# Altium project Signal Generator.PrjPcb (part 2 of 2)

## Sheet Interface.SchDoc
size A4; SheetNumber: 4; SheetTotal: 5
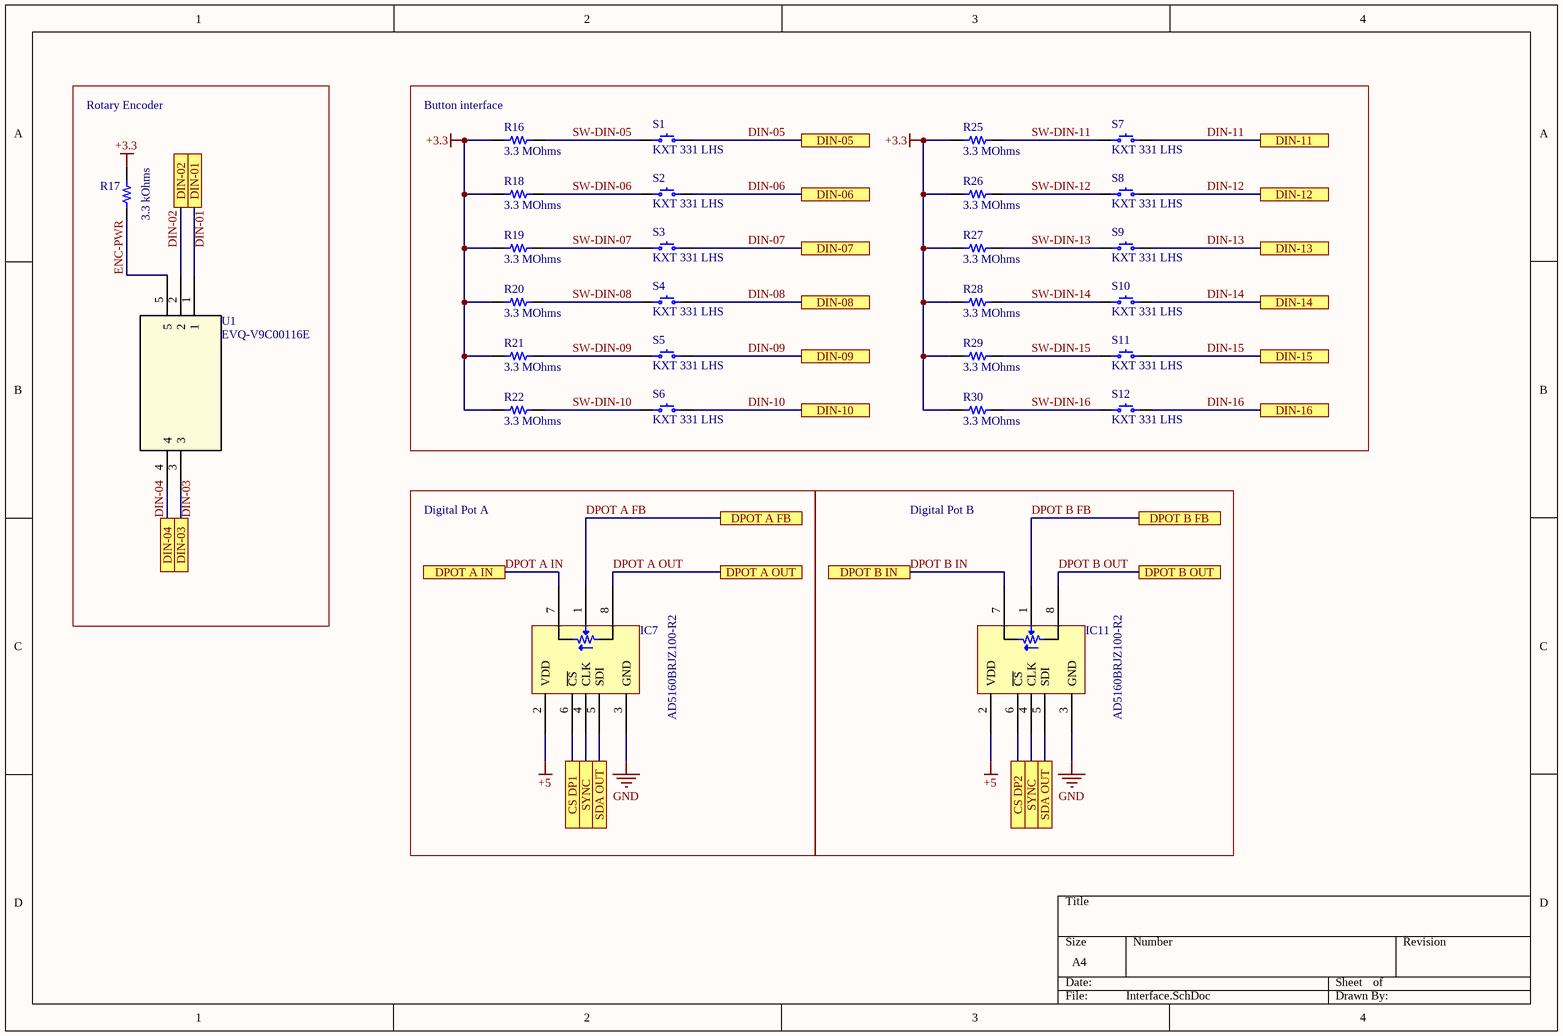
[diagram p3: Interface.SchDoc]

### Parts
IC7  AD5160BRJZ100-R2  [ANALOG SOT-23-8 RJ-8]
IC11  AD5160BRJZ100-R2  [ANALOG SOT-23-8 RJ-8]
R16  3.3 MOhms  [RES 1206_3216]
R17  3.3 kOhms  [RES 1206_3216]
R18  3.3 MOhms  [RES 1206_3216]
R19  3.3 MOhms  [RES 1206_3216]
R20  3.3 MOhms  [RES 1206_3216]
R21  3.3 MOhms  [RES 1206_3216]
R22  3.3 MOhms  [RES 1206_3216]
R25  3.3 MOhms  [RES 1206_3216]
R26  3.3 MOhms  [RES 1206_3216]
R27  3.3 MOhms  [RES 1206_3216]
R28  3.3 MOhms  [RES 1206_3216]
R29  3.3 MOhms  [RES 1206_3216]
R30  3.3 MOhms  [RES 1206_3216]
S1  KXT 331 LHS  [C&K KXT3]
S2  KXT 331 LHS  [C&K KXT3]
S3  KXT 331 LHS  [C&K KXT3]
S4  KXT 331 LHS  [C&K KXT3]
S5  KXT 331 LHS  [C&K KXT3]
S6  KXT 331 LHS  [C&K KXT3]
S7  KXT 331 LHS  [C&K KXT3]
S8  KXT 331 LHS  [C&K KXT3]
S9  KXT 331 LHS  [C&K KXT3]
S10  KXT 331 LHS  [C&K KXT3]
S11  KXT 331 LHS  [C&K KXT3]
S12  KXT 331 LHS  [C&K KXT3]
U1  EVQ-V9C00116E  [SW_EVQ-V9C00116E_PAN]

### Blocks framed on the sheet
Rotary Encoder: R17 U1
Button interface: R16 R18-R22 R25-R30 S1-S12
Digital Pot A: IC7
Digital Pot B: IC11

### Ports
CS DP1, CS DP2, DIN-01, DIN-02, DIN-03, DIN-04, DIN-05, DIN-06, DIN-07, DIN-08, DIN-09, DIN-10, DIN-11, DIN-12, DIN-13, DIN-14, DIN-15, DIN-16, DPOT A FB, DPOT A IN, DPOT A OUT, DPOT B FB, DPOT B IN, DPOT B OUT, SDA OUT, SYNC

### Nets
+3.3: R16.1 R17.2 R18.1 R19.1 R20.1 R21.1 R22.1 R25.1 R26.1 R27.1 R28.1 R29.1 R30.1  [project net 3.3V]
+5: IC7.2(VDD) IC11.2(VDD)
GND: IC7.3(GND) IC11.3(GND)
DIN-02: U1.2 ; port DIN-02
DIN-04: U1.4 ; port DIN-04
DIN-05: S1.2 ; port DIN-05
DIN-06: S2.2 ; port DIN-06
DIN-07: S3.2 ; port DIN-07
DIN-08: S4.2 ; port DIN-08
DIN-09: S5.2 ; port DIN-09
DIN-10: S6.2 ; port DIN-10
DIN-11: S7.2 ; port DIN-11
DIN-12: S8.2 ; port DIN-12
DIN-13: S9.2 ; port DIN-13
DIN-14: S10.2 ; port DIN-14
DIN-15: S11.2 ; port DIN-15
DIN-16: S12.2 ; port DIN-16
DPOT A FB: IC7.1(W) ; port DPOT A FB
DPOT A IN: IC7.7(A) ; port DPOT A IN
DPOT A OUT: IC7.8(B) ; port DPOT A OUT
DPOT B FB: IC11.1(W) ; port DPOT B FB
DPOT B IN: IC11.7(A) ; port DPOT B IN
DPOT B OUT: IC11.8(B) ; port DPOT B OUT
ENC-PWR: R17.1 U1.5
SDA OUT: IC7.5(SDI) IC11.5(SDI) ; port SDA OUT
SW-DIN-05: R16.2 S1.1
SW-DIN-06: R18.2 S2.1
SW-DIN-07: R19.2 S3.1
SW-DIN-08: R20.2 S4.1
SW-DIN-09: R21.2 S5.1
SW-DIN-10: R22.2 S6.1
SW-DIN-11: R25.2 S7.1
SW-DIN-12: R26.2 S8.1
SW-DIN-13: R27.2 S9.1
SW-DIN-14: R28.2 S10.1
SW-DIN-15: R29.2 S11.1
SW-DIN-16: R30.2 S12.1
SYNC: IC7.4(CLK) IC11.4(CLK) ; port SYNC
NetIC7_6: IC7.6(~{CS}) ; port CS DP1
NetIC11_6: IC11.6(~{CS}) ; port CS DP2
NetU1_1: U1.1 ; port DIN-01
NetU1_3: U1.3 ; port DIN-03

### Notes on the sheet
- Labels drawn without touching a wire or pin: DIN-01, DIN-03

### Library data of the parts
IC7 IC11 = AD5160BRJZ100-R2: IC DGTL POT 100KOHM 256TAP SOT23; Manufacturer: Analog Devices Inc.; Configuration: Potentiometer; Interface: SPI; Memory Type: Volatile; Number of Circuits: 1; Number of Taps: 256; Resistance (Ohms): 100k; Resistance - Wiper (Ohms) (Typ): 50; Temperature Coefficient (Typ): 45ppm/°C; Tolerance: ±15%; Voltage - Supply: 2.7V ~ 5.5V; Part Number: AD5160BRJZ100-R2; ComponentLink1Description: Datasheet; ComponentLink1URL: https://www.analog.com/media/en/technical-documentation/data-sheets/AD5160.pdf; ComponentLink2Description: DigiKey Link; ComponentLink2URL: http://digikey.com/product-detail/en/analog-devices-inc/AD5160BRJZ100-R2/AD5160BRJZ100-R2CT-ND/751230; LastUpdated: 3/06/2024 8:26:31 PM; Lifecycle Status: Active; Minimum Order: 1; Operating Temperature: -40°C ~ 125°C; Package / Case: SOT-23-8; Packaging: TapeAndReel; PartId: 39; Part Status: Active; Price: 1.68; Series: -; Supplier 1: DigiKey; Supplier Part Number 1: AD5160BRJZ100-R2CT-ND; Supplier Device Package: SOT-23-8; Taper: Linear
R16 R18-R22 R25-R30 = RG3216P-3304-B-T1: RES 3.3M OHM 0.1% 1/4W 1206; Manufacturer: Susumu; Power (Watts): 0.25W, 1/4W; Temperature Coefficient: ±25ppm/°C; Part Number: RG3216P-3304-B-T1; ComponentLink1Description: Datasheet; ComponentLink1URL: http://www.susumu.co.jp/common/pdf/n_catalog_partition01_en.pdf; ComponentLink2Description: DigiKey Link; ComponentLink2URL: https://www.digikey.com/en/products/detail/susumu/RG3216P-3304-B-T1/7035379; Composition: Thin Film; Device Package: 1206 (3216 Metric); Features: Anti-Sulfur, Automotive AEC-Q200; Height - Seated (Max): 0.020" (0.50mm); LastUpdated: 9/02/2024 8:54:00 PM; Lifecycle Status: Active; Minimum Order: 1; Number of Terminations: 2; Operating Temperature: -55°C ~ 155°C; Package / Case: 1206 (3216 Metric); Packaging: TapeAndReel; PartId: 38871; Part Status: Active; Price: 0.14; Ratings: AEC-Q200; Resistance: 3.3 MOhms; Series: RG; Size / Dimension: 0.126" L x 0.063" W (3.20mm x 1.60mm); Supplier 1: DigiKey; Supplier Part Number 1: 408-2035-1-ND; Supplier Device Package: 1206; Tolerance: ±0.1%; Value: 3.3 MOhms
R17 = ERA-8APB332V: RES SMD 3.3K OHM 0.1% 1/4W 1206; Manufacturer: Panasonic Electronic Components; Power (Watts): 0.25W, 1/4W; Temperature Coefficient: ±15ppm/°C; Part Number: ERA-8APB332V; ComponentLink1Description: Datasheet; ComponentLink1URL: https://industrial.panasonic.com/cdbs/www-data/pdf/RDM0000/AOA0000C307.pdf; ComponentLink2Description: DigiKey Link; ComponentLink2URL: https://www.digikey.com/en/products/detail/panasonic-electronic-components/ERA-8APB332V/5141025; Composition: Thin Film; Device Package: 1206 (3216 Metric); Features: Automotive AEC-Q200; Height - Seated (Max): 0.028" (0.70mm); LastUpdated: 9/02/2024 8:54:35 PM; Lifecycle Status: Active; Minimum Order: 1; Number of Terminations: 2; Operating Temperature: -55°C ~ 155°C; Package / Case: 1206 (3216 Metric); Packaging: TapeAndReel; PartId: 28968; Part Status: Active; Price: 0.31; Ratings: AEC-Q200; Resistance: 3.3 kOhms; Series: ERA-8A; Size / Dimension: 0.126" L x 0.063" W (3.20mm x 1.60mm); Supplier 1: DigiKey; Supplier Part Number 1: P3.3KCRCT-ND; Supplier Device Package: 1206; Tolerance: ±0.1%; Value: 3.3 kOhms
S1-S12 = KXT 331 LHS: SWITCH TACTILE SPST-NO 0.02A 15V; Manufacturer: C&K; Actuator Height off PCB, Vertical: 0.60mm; Actuator Orientation: Top Actuated; Actuator Type: Standard; Contact Rating @ Voltage: 0.02A @ 15VDC; Illumination: Non-Illuminated; Operating Force: 240gf; Outline: 3.00mm x 2.00mm; Switch Function: Off-Mom; Part Number: KXT 331 LHS; Circuit: SPST-NO; ComponentLink1Description: Datasheet; ComponentLink1URL: https://dznh3ojzb2azq.cloudfront.net/products/Tactile/KXT3/documents/datasheet.pdf; ComponentLink2Description: DigiKey Link; ComponentLink2URL: https://www.digikey.com/en/products/detail/c-k/KXT-331-LHS/6599754; LastUpdated: 3/06/2024 8:19:27 PM; Lifecycle Status: Active; Minimum Order: 1; Mounting Type: Surface Mount; Operating Temperature: -40°C ~ 85°C; Packaging: TapeAndReel; Part Status: Active; Price: 0.13; Series: KXT3; Supplier 1: DigiKey; Supplier Part Number 1: CKN10779CT-ND; Termination Style: SMD (SMT) Tab
U1 = EVQ-V9C00116E: No Description Available; Mfr_Name: Panasonic; RefDes: RefDes; Type: Type

## Sheet Shift register map.SchDoc
size A4; SheetNumber: 5; SheetTotal: 5
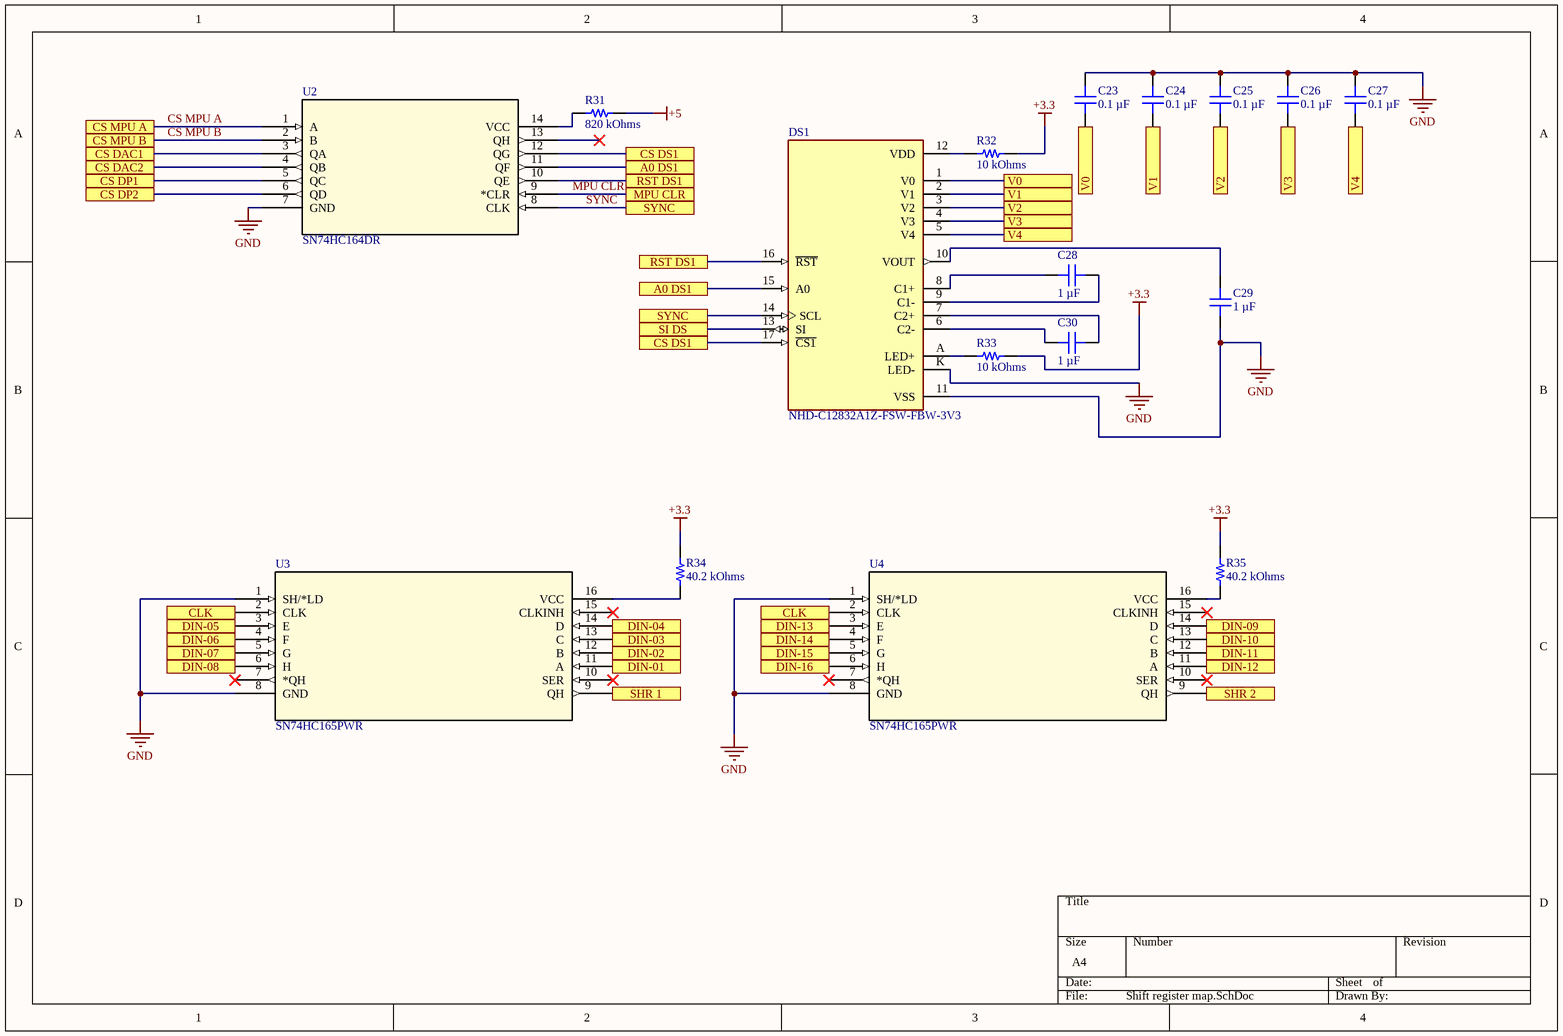
[diagram p4: Shift register map.SchDoc]

### Parts
C23  0.1 µF  [CAP 1210_3225 - 1MM]
C24  0.1 µF  [CAP 1210_3225 - 1MM]
C25  0.1 µF  [CAP 1210_3225 - 1MM]
C26  0.1 µF  [CAP 1210_3225 - 1MM]
C27  0.1 µF  [CAP 1210_3225 - 1MM]
C28  1 µF  [CAP 1210_3225 - 1MM]
C29  1 µF  [CAP 1210_3225 - 1MM]
C30  1 µF  [CAP 1210_3225 - 1MM]
DS1  NHD-C12832A1Z-FSW-FBW-3V3  [LCD_NHD-C12832A1Z-FSW-FBW-3V3]
R31  820 kOhms  [RES 1210_3225]
R32  10 kOhms  [RES 1210_3225]
R33  10 kOhms  [RES 1210_3225]
R34  40.2 kOhms  [RES 1206_3216]
R35  40.2 kOhms  [RES 1206_3216]
U2  SN74HC164DR  [SOP14]
U3  SN74HC165PWR  [PW16]
U4  SN74HC165PWR  [PW16]

### Ports
A0 DS1, CLK, CS DAC1, CS DAC2, CS DP1, CS DP2, CS DS1, CS MPU A, CS MPU B, DIN-01, DIN-02, DIN-03, DIN-04, DIN-05, DIN-06, DIN-07, DIN-08, DIN-09, DIN-10, DIN-11, DIN-12, DIN-13, DIN-14, DIN-15, DIN-16, MPU CLR, RST DS1, SHR 1, SHR 2, SI DS, SYNC, V0, V1, V2, V3, V4

### Nets
+3.3: R32.2 R33.2 R34.2 R35.2  [project net 3.3V]
+5: R31.2
GND: C23.2 C24.2 C25.2 C26.2 C27.2 C29.1 DS1.11(VSS) DS1.K(LED-) U2.7(GND) U3.1(SH/*LD) U3.8(GND) U4.1(SH/*LD) U4.8(GND)
CLK: U3.2(CLK) U4.2(CLK) ; port CLK
CS MPU A: U2.1(A) ; port CS MPU A
CS MPU B: U2.2(B) ; port CS MPU B
DIN-02: U3.12(B) ; port DIN-02
DIN-04: U3.14(D) ; port DIN-04
DIN-05: U3.3(E) ; port DIN-05
DIN-06: U3.4(F) ; port DIN-06
DIN-07: U3.5(G) ; port DIN-07
DIN-08: U3.6(H) ; port DIN-08
DIN-09: U4.14(D) ; port DIN-09
DIN-10: U4.13(C) ; port DIN-10
DIN-11: U4.12(B) ; port DIN-11
DIN-12: U4.11(A) ; port DIN-12
DIN-13: U4.3(E) ; port DIN-13
DIN-14: U4.4(F) ; port DIN-14
DIN-15: U4.5(G) ; port DIN-15
DIN-16: U4.6(H) ; port DIN-16
MPU CLR: U2.9(*CLR) ; port MPU CLR
SHR 1: U3.9(QH) ; port SHR 1
SHR 2: U4.9(QH) ; port SHR 2
SI DS: DS1.13(SI) ; port SI DS
SYNC: DS1.14(SCL) U2.8(CLK) ; port SYNC
NetC23_1: C23.1 DS1.1(V0) ; port V0
NetC24_1: C24.1 DS1.2(V1) ; port V1
NetC25_1: C25.1 DS1.3(V2) ; port V2
NetC26_1: C26.1 DS1.4(V3) ; port V3
NetC27_1: C27.1 DS1.5(V4) ; port V4
NetC28_1: C28.1 DS1.8(C1+)
NetC28_2: C28.2 DS1.9(C1-)
NetC29_2: C29.2 DS1.10(VOUT)
NetC30_1: C30.1 DS1.6(C2-)
NetC30_2: C30.2 DS1.7(C2+)
NetDS1_12: DS1.12(VDD) R32.1
NetDS1_15: DS1.15(A0) U2.11(QF) ; port A0 DS1
NetDS1_16: DS1.16(~{RST}) U2.10(QE) ; port RST DS1
NetDS1_17: DS1.17(~{CS1}) U2.12(QG) ; port CS DS1
NetDS1_A: DS1.A(LED+) R33.1
NetIC6_6: U2.3(QA) ; port CS DAC1
NetIC7_6: U2.5(QC) ; port CS DP1
NetIC8_6: U2.4(QB) ; port CS DAC2
NetIC11_6: U2.6(QD) ; port CS DP2
NetR31_1: R31.1 U2.14(VCC)
NetR34_1: R34.1 U3.16(VCC)
NetR35_1: R35.1 U4.16(VCC)
NetU1_1: U3.11(A) ; port DIN-01
NetU1_3: U3.13(C) ; port DIN-03

Not connected (* = marked no-connect by the designer): U2 13(QH)*; U3 7(*QH)* 10(SER)* 15(CLKINH)*; U4 7(*QH)* 10(SER)* 15(CLKINH)*

### Library data of the parts
C23-C27 = GMC32X7R104K100NT: CAP1210 X7R .1UF 10% 100V; manufacturer: Cal-Chip Electronics, Inc.; Part Number: GMC32X7R104K100NT; Value: 0.1 µF; Applications: General Purpose; Capacitance: 0.1 µF; componentlink1description: Datasheet; componentlink1url: https://calchip.com/wp-content/uploads/2023/05/gmc_series.pdf; componentlink2description: DigiKey Link; componentlink2url: https://www.digikey.com/en/products/detail/cal-chip-electronics-inc/GMC32X7R104K100NT/21802075; Device Package: 1210 (3225 Metric); lastupdated: 4/06/2024 7:20:42 PM; Lifecycle Status: Active; Minimum Order: 1; Mounting Type: Surface Mount, MLCC; Operating Temperature: -55°C ~ 125°C; Package / Case: 1210 (3225 Metric); packaging: TapeAndReel; partid: 58440; price: 0.05; series: GMC; Size / Dimension: 0.126" L x 0.098" W (3.20mm x 2.50mm); Supplier 1: DigiKey; Supplier Part Number 1: 4713-GMC32X7R104K100NTCT-ND; Temperature Coefficient: X7R; Thickness (Max): 0.087" (2.20mm); Tolerance: ±10%; Voltage - Rated: 100V
C28-C30 = GMC32X7R105K25NT: CAP1210 X7R 1UF 10% 25V; manufacturer: Cal-Chip Electronics, Inc.; Part Number: GMC32X7R105K25NT; Value: 1 µF; Applications: General Purpose; Capacitance: 1 µF; componentlink1description: Datasheet; componentlink1url: https://88ce57.p3cdn1.secureserver.net/wp-content/uploads/2023/01/gmc_series-2.pdf; componentlink2description: DigiKey Link; componentlink2url: https://www.digikey.com/en/products/detail/cal-chip-electronics-inc/GMC32X7R105K25NT/19910714; Device Package: 1210 (3225 Metric); lastupdated: 4/06/2024 7:20:43 PM; Lifecycle Status: Active; Minimum Order: 1; Mounting Type: Surface Mount, MLCC; Operating Temperature: -55°C ~ 125°C; Package / Case: 1210 (3225 Metric); packaging: TapeAndReel; partid: 56654; price: 0.06; series: GMC; Size / Dimension: 0.126" L x 0.098" W (3.20mm x 2.50mm); Supplier 1: DigiKey; Supplier Part Number 1: 4713-GMC32X7R105K25NTCT-ND; Temperature Coefficient: X7R; Thickness (Max): 0.071" (1.80mm); Tolerance: ±10%; Voltage - Rated: 25V
DS1 = NHD-C12832A1Z-FSW-FBW-3V3: Graphic LCD Display Module Transflective Black (White - Inverted) FSTN - Film Super-Twisted Nematic SPI 128 x 32; MF: Newhaven; Package: None; Purchase-URL: https://pricing.snapeda.com/search/part/NHD-C12832A1Z-FSW-FBW-3V3/?ref=eda; Price: None; Availability: Good; Check_prices: https://www.snapeda.com/parts/NHD-C12832A1Z-FSW-FBW-3V3/Newhaven%20Display%20Intl/view-part/275499/?ref=eda; MP: NHD-C12832A1Z-FSW-FBW-3V3; SnapEDA_Link: https://www.snapeda.com/parts/NHD-C12832A1Z-FSW-FBW-3V3/Newhaven%20Display%20Intl/view-part/275499/?ref=snap; Value: *
R31 = RMCF1210JT820K: RES 820K OHM 5% 1/3W 1210; Manufacturer: Stackpole Electronics Inc; Power (Watts): 0.333W, 1/3W; Temperature Coefficient: ±200ppm/°C; Part Number: RMCF1210JT820K; ComponentLink1Description: Datasheet; ComponentLink1URL: https://www.seielect.com/catalog/sei-rmcf_rmcp.pdf; ComponentLink2Description: DigiKey Link; ComponentLink2URL: https://www.digikey.com/en/products/detail/stackpole-electronics-inc/RMCF1210JT820K/1757292; Composition: Thick Film; Device Package: 1210 (3225 Metric); Features: Automotive AEC-Q200; Height - Seated (Max): 0.028" (0.70mm); LastUpdated: 3/06/2024 8:18:51 PM; Lifecycle Status: Active; Minimum Order: 1; Number of Terminations: 2; Operating Temperature: -55°C ~ 155°C; Package / Case: 1210 (3225 Metric); Packaging: TapeAndReel; Part Status: Active; Price: 0.02; Ratings: AEC-Q200; Resistance: 820 kOhms; Series: RMCF; Size / Dimension: 0.126" L x 0.098" W (3.20mm x 2.50mm); Supplier 1: DigiKey; Supplier Part Number 1: RMCF1210JT820KCT-ND; Supplier Device Package: 1210; Tolerance: ±5%; Value: 820 kOhms
R32 R33 = TNPW121010K0BEEN: RES 10K OHM 0.1% 1/2W 1210; Manufacturer: Vishay Dale; Power (Watts): 0.5W, 1/2W; Temperature Coefficient: ±25ppm/°C; Part Number: TNPW121010K0BEEN; ComponentLink1Description: Datasheet; ComponentLink1URL: http://www.vishay.com/docs/28758/tnpw_e3.pdf; ComponentLink2Description: DigiKey Link; ComponentLink2URL: https://www.digikey.com/en/products/detail/vishay-dale/TNPW121010K0BEEN/1611704; Composition: Thin Film; Device Package: 1210 (3225 Metric); Features: Anti-Sulfur, Automotive AEC-Q200, Moisture Resistant; Height - Seated (Max): 0.030" (0.75mm); LastUpdated: 3/06/2024 8:18:52 PM; Lifecycle Status: Active; Minimum Order: 1; Number of Terminations: 2; Operating Temperature: -55°C ~ 155°C; Package / Case: 1210 (3225 Metric); Packaging: TapeAndReel; Part Status: Active; Price: 0.91; Ratings: AEC-Q200; Resistance: 10 kOhms; Series: TNPW e3; Size / Dimension: 0.126" L x 0.096" W (3.20mm x 2.45mm); Supplier 1: DigiKey; Supplier Part Number 1: 541-TNPW121010K0BEENCT-ND; Supplier Device Package: 1210; Tolerance: ±0.1%; Value: 10 kOhms
R34 R35 = RMCF1206FT40K2: RES 40.2K OHM 1% 1/4W 1206; Manufacturer: Stackpole Electronics Inc; Power (Watts): 0.25W, 1/4W; Temperature Coefficient: ±100ppm/°C; Part Number: RMCF1206FT40K2; ComponentLink1Description: Datasheet; ComponentLink1URL: https://www.seielect.com/catalog/sei-rmcf_rmcp.pdf; ComponentLink2Description: DigiKey Link; ComponentLink2URL: https://www.digikey.com/en/products/detail/stackpole-electronics-inc/RMCF1206FT40K2/1754014; Composition: Thick Film; Device Package: 1206 (3216 Metric); Features: Automotive AEC-Q200; Height - Seated (Max): 0.028" (0.70mm); LastUpdated: 9/02/2024 8:54:45 PM; Lifecycle Status: Active; Minimum Order: 1; Number of Terminations: 2; Operating Temperature: -55°C ~ 155°C; Package / Case: 1206 (3216 Metric); Packaging: TapeAndReel; PartId: 26907; Part Status: Active; Price: 0.01; Ratings: AEC-Q200; Resistance: 40.2 kOhms; Series: RMCF; Size / Dimension: 0.126" L x 0.063" W (3.20mm x 1.60mm); Supplier 1: DigiKey; Supplier Part Number 1: RMCF1206FT40K2CT-ND; Supplier Device Package: 1206; Tolerance: ±1%; Value: 40.2 kOhms
U2 = SN74HC164DR: No Description Available; Mfr_Name: Texas Instruments; RefDes: RefDes; Type: Type
U3 U4 = SN74HC165PWR: No Description Available; Mfr_Name: Texas Instruments; RefDes: RefDes; Type: Type

## Nets that join several sheets
3.3V: PIC (9 pins), Power management (5 pins), Interface (13 pins), Shift register map (R32.2 R33.2 R34.2 R35.2)
+5: Power management (C20.1 D11.1 IC3.5 TP12.TP1), Interface (IC7.2 IC11.2), Shift register map (R31.2)
+6.5V: Power management (6 pins), Oscillator (IC6.3 IC8.3)
+12: Power management (6 pins), Oscillator (IC4.8 IC5.8)
-12: Power management (5 pins), Oscillator (IC4.4 IC5.4)
GND: PIC (21 pins), Power management (30 pins), Oscillator (12 pins), Interface (IC7.3 IC11.3), Shift register map (13 pins)
CLK: PIC (J3.13), Shift register map (U3.2 U4.2)
CS MPU A: PIC (J3.23), Shift register map (U2.1)
CS MPU B: PIC (J3.24), Shift register map (U2.2)
DIN-02: Interface (U1.2), Shift register map (U3.12)
DIN-04: Interface (U1.4), Shift register map (U3.14)
DIN-05: Interface (S1.2), Shift register map (U3.3)
DIN-06: Interface (S2.2), Shift register map (U3.4)
DIN-07: Interface (S3.2), Shift register map (U3.5)
DIN-08: Interface (S4.2), Shift register map (U3.6)
DIN-09: Interface (S5.2), Shift register map (U4.14)
DIN-10: Interface (S6.2), Shift register map (U4.13)
DIN-11: Interface (S7.2), Shift register map (U4.12)
DIN-12: Interface (S8.2), Shift register map (U4.11)
DIN-13: Interface (S9.2), Shift register map (U4.3)
DIN-14: Interface (S10.2), Shift register map (U4.4)
DIN-15: Interface (S11.2), Shift register map (U4.5)
DIN-16: Interface (S12.2), Shift register map (U4.6)
DPOT A FB: Oscillator (IC5.2), Interface (IC7.1)
DPOT A IN: Oscillator (IC4.1 IC4.2), Interface (IC7.7)
DPOT A OUT: Oscillator (IC5.1 J5.1), Interface (IC7.8)
DPOT B FB: Oscillator (IC5.6), Interface (IC11.1)
DPOT B IN: Oscillator (IC4.6 IC4.7), Interface (IC11.7)
DPOT B OUT: Oscillator (IC5.7 J6.1), Interface (IC11.8)
MPU CLR: PIC (J3.22), Shift register map (U2.9)
NetIC6_6: Oscillator (IC6.6), Shift register map (U2.3)
NetIC7_6: Interface (IC7.6), Shift register map (U2.5)
NetIC8_6: Oscillator (IC8.6), Shift register map (U2.4)
NetIC11_6: Interface (IC11.6), Shift register map (U2.6)
NetU1_1: Interface (U1.1), Shift register map (U3.11)
NetU1_3: Interface (U1.3), Shift register map (U3.13)
SDA OUT: PIC (J3.16), Oscillator (IC6.4 IC8.4), Interface (IC7.5 IC11.5)
SHR 1: PIC (J3.17), Shift register map (U3.9)
SHR 2: PIC (J3.18), Shift register map (U4.9)
SI DS: PIC (J3.21), Shift register map (DS1.13)
SYNC: PIC (J3.14), Power management (TP8.TP1), Oscillator (IC6.5 IC8.5), Interface (IC7.4 IC11.4), Shift register map (DS1.14 U2.8)
Y_N: PIC (C21.2 J3.10 Y1.1), Power management (TP7.TP1)
Y_P: PIC (C16.2 J3.9 Y1.2), Power management (TP6.TP1)